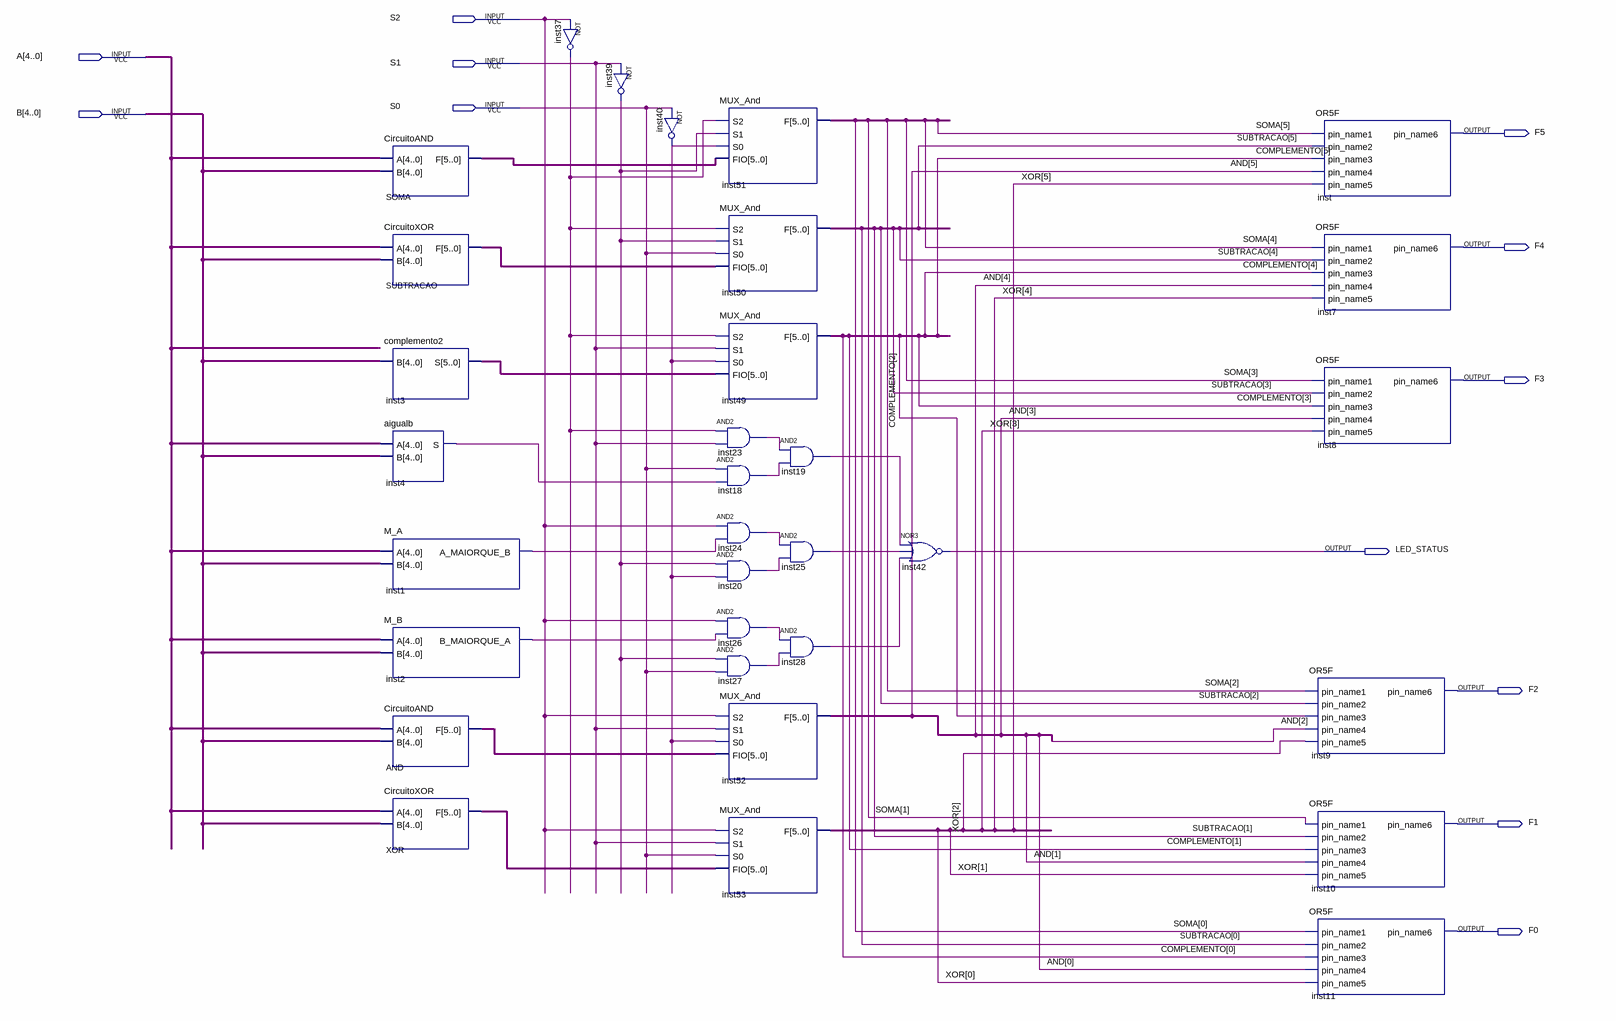
[diagram p0: schematic sheet]
// Quartus schematic ULA.bdf as structural Verilog: 32 symbols, 12 pins
module ULA (
  input  S2,
  input  [4:0] A,
  input  S1,
  input  S0,
  input  [4:0] B,
  output F5,
  output F4,
  output F3,
  output LED_STATUS,
  output F2,
  output F1,
  output F0
);

  wire inst1_a_maiorque_b, inst2_b_maiorque_a, inst4_s, inst18_out, inst19_out, inst20_out, inst23_out,
       inst24_out, inst25_out, inst26_out, inst27_out, inst28_out, inst37_out, inst39_out, inst40_out;
  wire [5:0] AND, AND_f, COMPLEMENTO, inst3_s, inst49_f, inst50_f, inst51_f, inst52_f, inst53_f, SOMA,
       SOMA_f, SUBTRACAO, SUBTRACAO_f, XOR, XOR_f;

  CircuitoAND u_SOMA (.A(A), .B(B), .F(SOMA_f));
  CircuitoXOR u_SUBTRACAO (.A(A), .B(B), .F(SUBTRACAO_f));
  complemento2 inst3 (.B(B), .S(inst3_s));
  aigualb inst4 (.A(A), .B(B), .S(inst4_s));
  M_A inst1 (.A(A), .B(B), .A_MAIORQUE_B(inst1_a_maiorque_b));
  M_B inst2 (.A(A), .B(B), .B_MAIORQUE_A(inst2_b_maiorque_a));
  CircuitoAND u_AND (.A(A), .B(B), .F(AND_f));
  CircuitoXOR u_XOR (.A(A), .B(B), .F(XOR_f));
  not inst37 (inst37_out, S2);
  not inst39 (inst39_out, S1);
  not inst40 (inst40_out, S0);
  MUX_And inst51 (.S2(inst37_out), .S1(inst39_out), .S0(inst40_out), .FIO(SOMA_f), .F(inst51_f));
  MUX_And inst50 (.S2(inst37_out), .S1(inst39_out), .S0(S0), .FIO(SUBTRACAO_f), .F(inst50_f));
  MUX_And inst49 (.S2(inst37_out), .S1(S1), .S0(inst40_out), .FIO(inst3_s), .F(inst49_f));
  and inst23 (inst23_out, inst37_out, S1);
  and inst18 (inst18_out, S0, inst4_s);
  and inst24 (inst24_out, S2, inst1_a_maiorque_b);
  and inst20 (inst20_out, inst39_out, inst40_out);
  and inst26 (inst26_out, S2, inst2_b_maiorque_a);
  and inst27 (inst27_out, inst39_out, S0);
  MUX_And inst52 (.S2(S2), .S1(S1), .S0(inst40_out), .FIO(AND_f), .F(inst52_f));
  MUX_And inst53 (.S2(S2), .S1(S1), .S0(S0), .FIO(XOR_f), .F(inst53_f));
  and inst19 (inst19_out, inst23_out, inst18_out);
  and inst25 (inst25_out, inst24_out, inst20_out);
  and inst28 (inst28_out, inst26_out, inst27_out);
  nor inst42 (LED_STATUS, inst19_out, inst25_out, inst28_out);
  OR5F inst (
    .pin_name1(SOMA[5]), .pin_name2(SUBTRACAO[5]), .pin_name3(COMPLEMENTO[5]), .pin_name4(AND[5]),
    .pin_name5(XOR[5]), .pin_name6(F5));
  OR5F inst7 (
    .pin_name1(SOMA[4]), .pin_name2(SUBTRACAO[4]), .pin_name3(COMPLEMENTO[4]), .pin_name4(AND[4]),
    .pin_name5(XOR[4]), .pin_name6(F4));
  OR5F inst8 (
    .pin_name1(SOMA[3]), .pin_name2(SUBTRACAO[3]), .pin_name3(COMPLEMENTO[3]), .pin_name4(AND[3]),
    .pin_name5(XOR[3]), .pin_name6(F3));
  OR5F inst9 (
    .pin_name1(SOMA[2]), .pin_name2(SUBTRACAO[2]), .pin_name3(COMPLEMENTO[2]), .pin_name4(AND[2]),
    .pin_name5(XOR[2]), .pin_name6(F2));
  OR5F inst10 (
    .pin_name1(SOMA[1]), .pin_name2(SUBTRACAO[1]), .pin_name3(COMPLEMENTO[1]), .pin_name4(AND[1]),
    .pin_name5(XOR[1]), .pin_name6(F1));
  OR5F inst11 (
    .pin_name1(SOMA[0]), .pin_name2(SUBTRACAO[0]), .pin_name3(COMPLEMENTO[0]), .pin_name4(AND[0]),
    .pin_name5(XOR[0]), .pin_name6(F0));
endmodule
